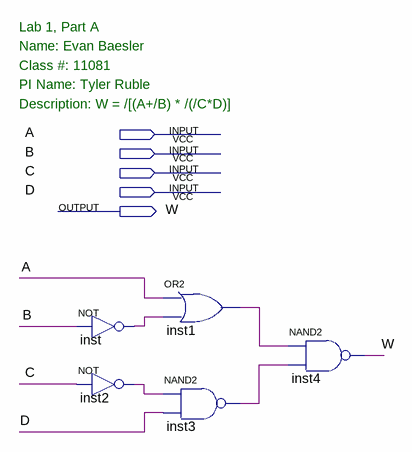
[diagram p0: schematic sheet]
// Quartus schematic lab1a.bdf as structural Verilog: 5 symbols, 5 pins
module lab1a (
  input  A,
  input  B,
  input  C,
  input  D,
  output W
);

  wire inst1_out, inst2_out, inst3_out, inst_out;

  not inst (inst_out, B);
  not inst2 (inst2_out, C);
  or inst1 (inst1_out, A, inst_out);
  nand inst3 (inst3_out, inst2_out, D);
  nand inst4 (W, inst1_out, inst3_out);

  // Notes on the sheet:
  //   Lab 1, Part A
  //   Name: Evan Baesler
  //   Class #: 11081
  //   PI Name: Tyler Ruble
  //   Description: W = /[(A+/B) * /(/C*D)]
endmodule
